# EasyEDA schematic sch.easyeda.json
TITLE: PowMr RS232 <-> ESP32; REV: 1.0; Date: 2023-06-27; Sheet: 1/1; Drawn By: Davide Beatrici
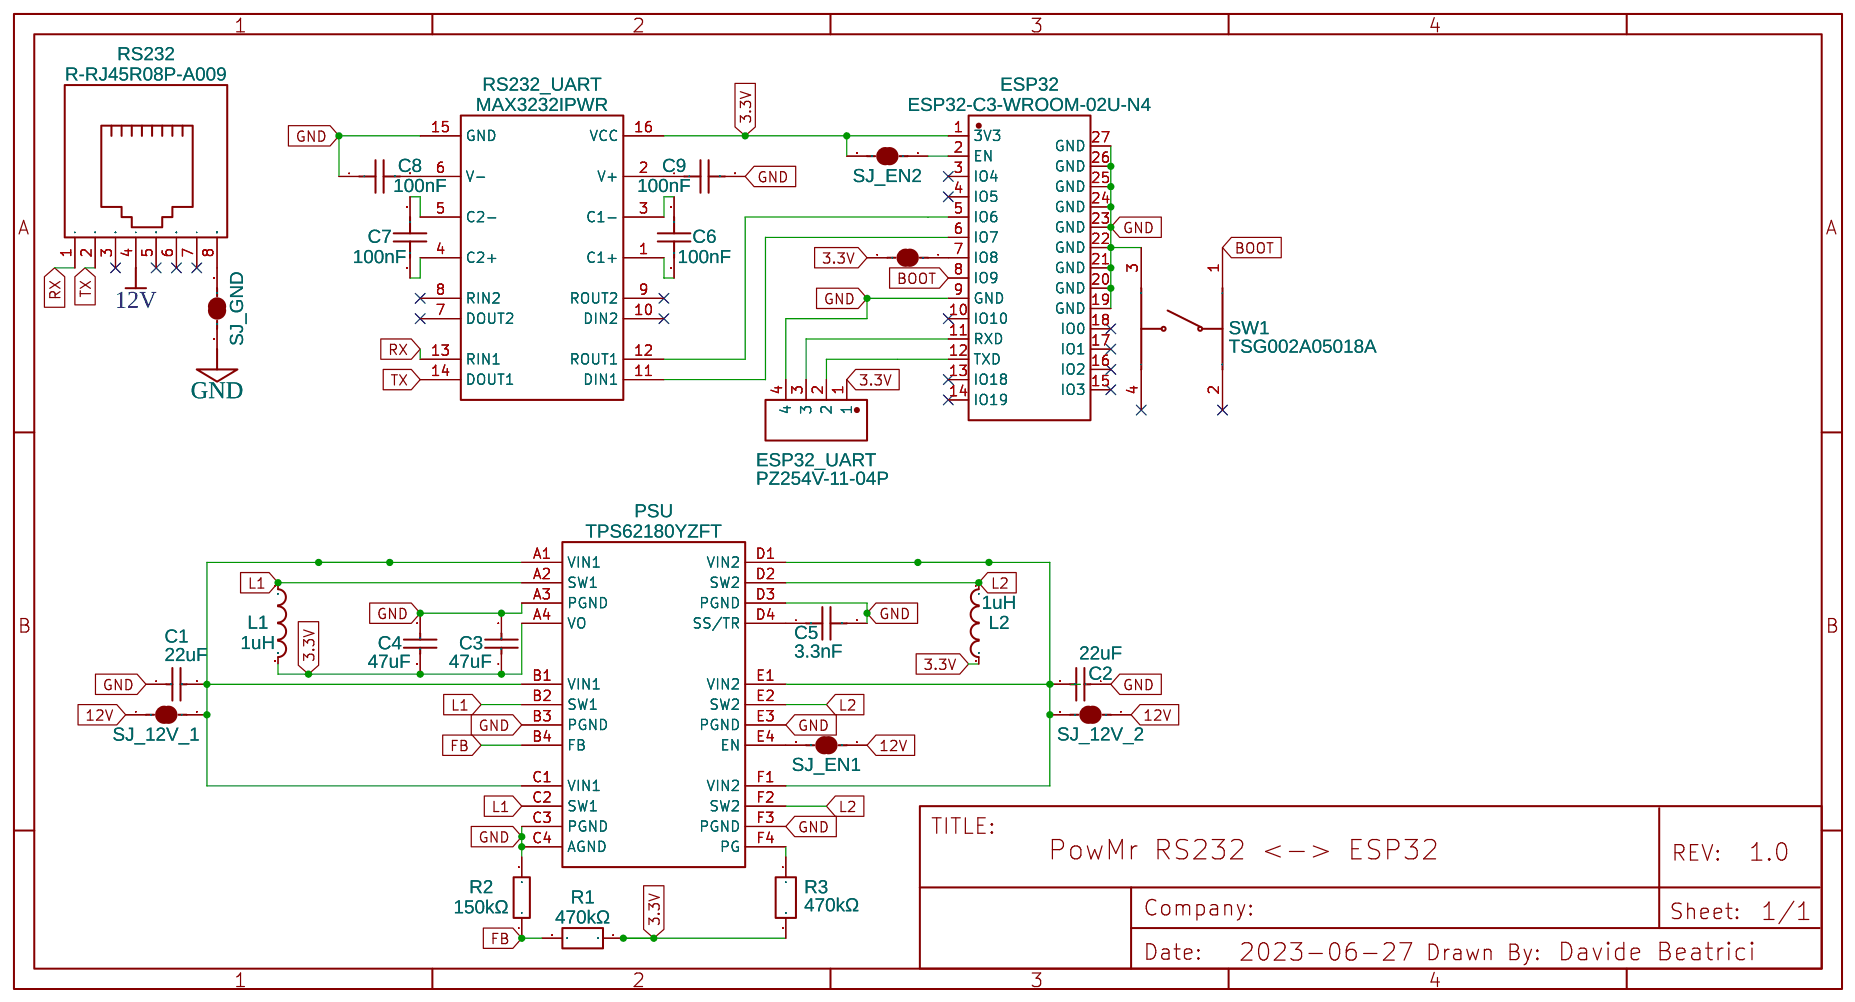
[diagram p0: schematic sheet]

## Parts
C1  22uF  [C0805]
C2  22uF  [C0805]
C3  47uF  [C0805]
C4  47uF  [C0805]
C5  3.3nF  [C0402]
C6  100nF  [C0402]
C7  100nF  [C0402]
C8  100nF  [C0402]
C9  100nF  [C0402]
ESP32  ESP32-C3-WROOM-02U-N4  [WIFI-SMD_L18.0-W14.3_ESP32-C3-WROOM-02U-N4]
ESP32_UART  PZ254V-11-04P  [HDR-TH_4P-P2.54-V-M]
L1  1uH  [L2520]
L2  1uH  [L2520]
PSU  TPS62180YZFT  [DSBGA-24_L3.1-W2.1-R4-C6-P0.50-BL]
R1  470kΩ  [R0402]
R2  150kΩ  [R0402]
R3  470kΩ  [R0402]
RS232  R-RJ45R08P-A009  [RJ45-TH_R-RJ45R08P-A009]
RS232_UART  MAX3232IPWR  [TSSOP-16_L5.0-W4.4-P0.65-LS6.4-BL]
SJ_12V_1  SJ_12V_1  [SJ_2S-NOTRACE]
SJ_12V_2  SJ_12V_2  [SJ_2S-NOTRACE]
SJ_EN1  SJ_EN1  [SJ_2S-NOTRACE]
SJ_EN2  SJ_EN2  [SJ_2S-NOTRACE]
SJ_GND  SJ_GND  [SJ_2S-NOTRACE]
SJ_IO8  SJ_IO8  [SJ_2S-NOTRACE]
SW1  TSG002A05018A  [SW-SMD_4P-L6.2-W6.2-P4.50-LS9.2]

## Library data of the parts
C1 C2 = GRM21BR61E226ME44L: Supplier: LCSC; Manufacturer: muRata(村田); Supplier Part: C86816; JLCPCB Part Class: Extended Part
C3 C4 = GRM21BR60J476ME15L: Supplier: LCSC; Manufacturer: muRata(村田); Supplier Part: C77072; JLCPCB Part Class: Extended Part
C5 = GRM155R71H332KA01D: Supplier: LCSC; Manufacturer: muRata(村田); Supplier Part: C85963; JLCPCB Part Class: Extended Part
C6-C9 = GRM155R71C104KA88D: Supplier: LCSC; Manufacturer: muRata(村田); Supplier Part: C71629; JLCPCB Part Class: Extended Part
ESP32 = ESP32-C3-WROOM-02U-N4: Supplier: LCSC; Supplier Part: C2926676; Manufacturer: ESPRESSIF(乐鑫); Contributor: LCSC; JLCPCB Part Class: Extended Part
ESP32_UART = PZ254V-11-04P: Supplier: LCSC; Supplier Part: C492403; Manufacturer: XFCN(兴飞); Contributor: LCSC; JLCPCB Part Class: Extended Part
L1 L2 = DFE252012F-1R0M=P2: Supplier: LCSC; Supplier Part: C435392; Manufacturer: muRata(村田); Contributor: LCSC; JLCPCB Part Class: Extended Part
PSU = TPS62180YZFT: Supplier: LCSC; Supplier Part: C73980; Manufacturer: TI(德州仪器); Contributor: LCSC; JLCPCB Part Class: Extended Part
R1 R3 = CRCW0402470KFKED: Supplier: LCSC; Supplier Part: C482181; Manufacturer: VISHAY(威世); Contributor: LCSC; JLCPCB Part Class: Extended Part
R2 = 0402WGF1503TCE: Supplier: LCSC; Manufacturer: UNI-ROYAL(厚声); Supplier Part: C25755; Resistance (Ohms): 150K; JLCPCB Part Class: Basic Part
RS232 = R-RJ45R08P-A009: Supplier: LCSC; Supplier Part: C2902700; Manufacturer: Ckmtw(灿科盟); Contributor: LCSC; JLCPCB Part Class: Extended Part
RS232_UART = MAX3232IPWR: Supplier: LCSC; Manufacturer: TI(德州仪器); Contributor: LCSC; Supplier Part: C113205; JLCPCB Part Class: Extended Part
SJ_12V_1 SJ_12V_2 SJ_EN1 SJ_EN2 SJ_GND SJ_IO8 = SOLDERJUMPERNC2: Solder Jumper
SW1 = TSG002A05018A: Supplier: LCSC; Supplier Part: C2888616; Manufacturer: BZCN(博众电气); Contributor: LCSC; JLCPCB Part Class: Extended Part

## Nets
3.3V: C3.1 C4.1 ESP32.1(3V3) ESP32_UART.1 L1.2 L2.2 PSU.A4(VO) R1.1 R3.2 RS232_UART.16(VCC) SJ_EN2.2 SJ_IO8.2
12V: RS232.4 SJ_12V_1.1 SJ_12V_2.1 SJ_EN1.1
GND: C1.1 C2.1 C3.2 C4.2 C5.2 C8.1 C9.2 ESP32.9(GND) ESP32.19(GND) ESP32.20(GND) ESP32.21(GND) ESP32.22(GND) ESP32.23(GND) ESP32.24(GND) ESP32.25(GND) ESP32.26(GND) ESP32.27(GND) ESP32_UART.4 PSU.A3(PGND) PSU.B3(PGND) PSU.C3(PGND) PSU.C4(AGND) PSU.D3(PGND) PSU.E3(PGND) PSU.F3(PGND) R2.2 RS232_UART.15(GND) SJ_GND.1 SW1.3
BOOT: ESP32.8(IO9) SW1.1
FB: PSU.B4(FB) R1.2 R2.1
L1: L1.1 PSU.A2(SW1) PSU.B2(SW1) PSU.C2(SW1)
L2: L2.1 PSU.D2(SW2) PSU.E2(SW2) PSU.F2(SW2)
RX: RS232.1 RS232_UART.13(RIN1)
TX: RS232.2 RS232_UART.14(DOUT1)
Net-(C1-2): C1.2 PSU.A1(VIN1) PSU.B1(VIN1) PSU.C1(VIN1) SJ_12V_1.2
Net-(C2-2): C2.2 PSU.D1(VIN2) PSU.E1(VIN2) PSU.F1(VIN2) SJ_12V_2.2
Net-(C5-1): C5.1 PSU.D4(SS/TR)
Net-(C6-1): C6.1 RS232_UART.1(C1+)
Net-(C6-2): C6.2 RS232_UART.3(C1-)
Net-(C7-1): C7.1 RS232_UART.4(C2+)
Net-(C7-2): C7.2 RS232_UART.5(C2-)
Net-(C8-2): C8.2 RS232_UART.6(V-)
Net-(C9-1): C9.1 RS232_UART.2(V+)
Net-(ESP32-2): ESP32.2(EN) SJ_EN2.1
Net-(ESP32-5): ESP32.5(IO6) RS232_UART.12(ROUT1)
Net-(ESP32-6): ESP32.6(IO7) RS232_UART.11(DIN1)
Net-(ESP32-7): ESP32.7(IO8) SJ_IO8.1
Net-(ESP32-11): ESP32.11(RXD) ESP32_UART.3
Net-(ESP32-12): ESP32.12(TXD) ESP32_UART.2
Net-(PSU-E4): PSU.E4(EN) SJ_EN1.2
Net-(PSU-F4): PSU.F4(PG) R3.1
Net-(RS232-8): RS232.8 SJ_GND.2

Not connected (* = marked no-connect by the designer): ESP32 3(IO4)* 4(IO5)* 10(IO10)* 13(IO18)* 14(IO19)* 15(IO3)* 16(IO2)* 17(IO1)* 18(IO0)*; RS232 3* 5* 6* 7*; RS232_UART 7(DOUT2)* 8(RIN2)* 9(ROUT2)* 10(DIN2)*; SW1 2* 4*
